# Altium schematic sheet Detector.SchDoc
size A4
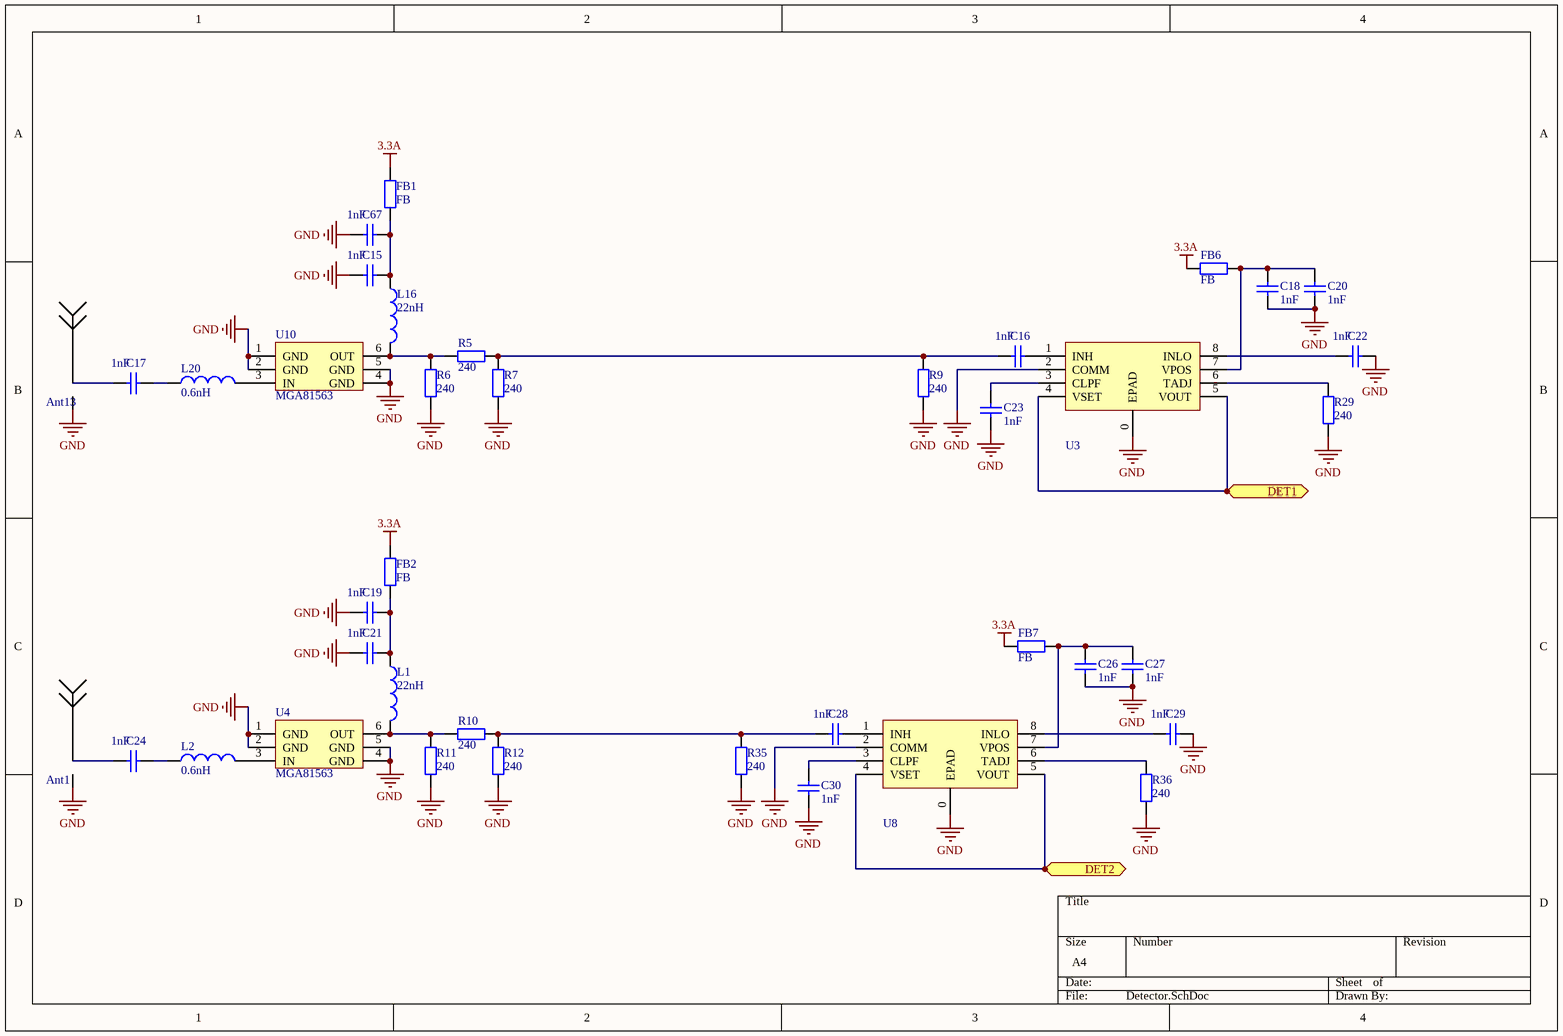
[diagram p0: Detector.SchDoc]

## Parts
Ant1  Antenna  [SMA-2]  (value not drawn)
Ant13  Antenna  [SMA-2]  (value not drawn)
C15  1nF  [0402]
C16  1nF  [0402]
C17  1nF  [0402]
C18  1nF  [0402]
C19  1nF  [0402]
C20  1nF  [0402]
C21  1nF  [0402]
C22  1nF  [0402]
C23  1nF  [0402]
C24  1nF  [0402]
C26  1nF  [0402]
C27  1nF  [0402]
C28  1nF  [0402]
C29  1nF  [0402]
C30  1nF  [0402]
C67  1nF  [0402]
FB1  FB  [0402]
FB2  FB  [0402]
FB6  FB  [0402]
FB7  FB  [0402]
L1  value 22nH  [0402]  (hidden comment: Inductor)
L2  value 0.6nH  [0402]  (hidden comment: Inductor)
L16  value 22nH  [0402]  (hidden comment: Inductor)
L20  value 0.6nH  [0402]  (hidden comment: Inductor)
R5  240  [0402]
R6  240  [0402]
R7  240  [0402]
R9  240  [0402]
R10  240  [0402]
R11  240  [0402]
R12  240  [0402]
R29  240  [0402]
R35  240  [0402]
R36  240  [0402]
U3  AD8319  [AD8319]  (value not drawn)
U4  MGA81563  [SC-70-6]
U8  AD8319  [AD8319]  (value not drawn)
U10  MGA81563  [SC-70-6]

## Ports
DET1, DET2

## Nets
3.3A: FB1.1 FB2.1 FB6.1 FB7.1
GND: Ant1.GND(G) Ant13.GND(G) C15.1 C18.1 C19.1 C20.1 C21.1 C22.2 C23.1 C26.1 C27.1 C29.2 C30.1 C67.1 R6.2 R7.2 R9.2 R11.2 R12.2 R29.2 R35.2 R36.2 U3.0(EPAD) U3.2(COMM) U4.1(GND) U4.2(GND) U4.4(GND) U4.5(GND) U8.0(EPAD) U8.2(COMM) U10.1(GND) U10.2(GND) U10.4(GND) U10.5(GND)
DET1: U3.4(VSET) U3.5(VOUT) ; port DET1
DET2: U8.4(VSET) U8.5(VOUT) ; port DET2
NetAnt1_1: Ant1.1 C24.1
NetAnt13_1: Ant13.1 C17.1
NetC15_2: C15.2 C67.2 FB1.2 L16.1
NetC16_1: C16.1 R5.2 R7.1 R9.1
NetC16_2: C16.2 U3.1(INH)
NetC17_2: C17.2 L20.1
NetC18_2: C18.2 C20.2 FB6.2 U3.7(VPOS)
NetC19_2: C19.2 C21.2 FB2.2 L1.1
NetC22_1: C22.1 U3.8(INLO)
NetC23_2: C23.2 U3.3(CLPF)
NetC24_2: C24.2 L2.1
NetC26_2: C26.2 C27.2 FB7.2 U8.7(VPOS)
NetC28_1: C28.1 R10.2 R12.1 R35.1
NetC28_2: C28.2 U8.1(INH)
NetC29_1: C29.1 U8.8(INLO)
NetC30_2: C30.2 U8.3(CLPF)
NetL1_2: L1.2 R10.1 R11.1 U4.6(OUT)
NetL2_2: L2.2 U4.3(IN)
NetL16_2: L16.2 R5.1 R6.1 U10.6(OUT)
NetL20_2: L20.2 U10.3(IN)
NetR29_1: R29.1 U3.6(TADJ)
NetR36_1: R36.1 U8.6(TADJ)

## Library data of the parts
C15-C24 C26-C30 C67 = Cap: Capacitor; Published: 8-Jun-2000; LatestRevisionDate: 17-Jul-2002; LatestRevisionNote: Re-released for DXP Platform.; PackageReference: RAD-0.3; Publisher: Altium Limited; PackageDescription: Radial Cap, Thru-Hole; 2 Leads; 0.3 in Pin Spacing
FB1 FB2 FB6 FB7 R5-R7 R9-R12 R29 R35 R36 = Res2: Resistor; Published: 8-Jun-2000; LatestRevisionDate: 17-Jul-2002; LatestRevisionNote: Re-released for DXP Platform.; PackageReference: AXIAL-0.4; Publisher: Altium Limited; PackageDescription: Axial Device, Thru-Hole; 2 Leads; 0.4 in Pin Spacing
L1 L2 L16 L20 = Inductor: Code_IEC: 1005; Published: 8-Jun-2000; LatestRevisionDate: 29-May-2009; LatestRevisionNote: IPC-7351 Footprint Added.; PackageReference: 0402-A; Publisher: Altium Limited; PackageDescription: Chip Inductor; Code_JEITA: 0402